# EasyEDA schematic SCH_PCB_33KV_2026-04-21.json
TITLE: Sheet_1; REV: 1.0; Date: 2026-04-07; Sheet: 1/1; Drawn By: gamepoko56; Company: Your Company
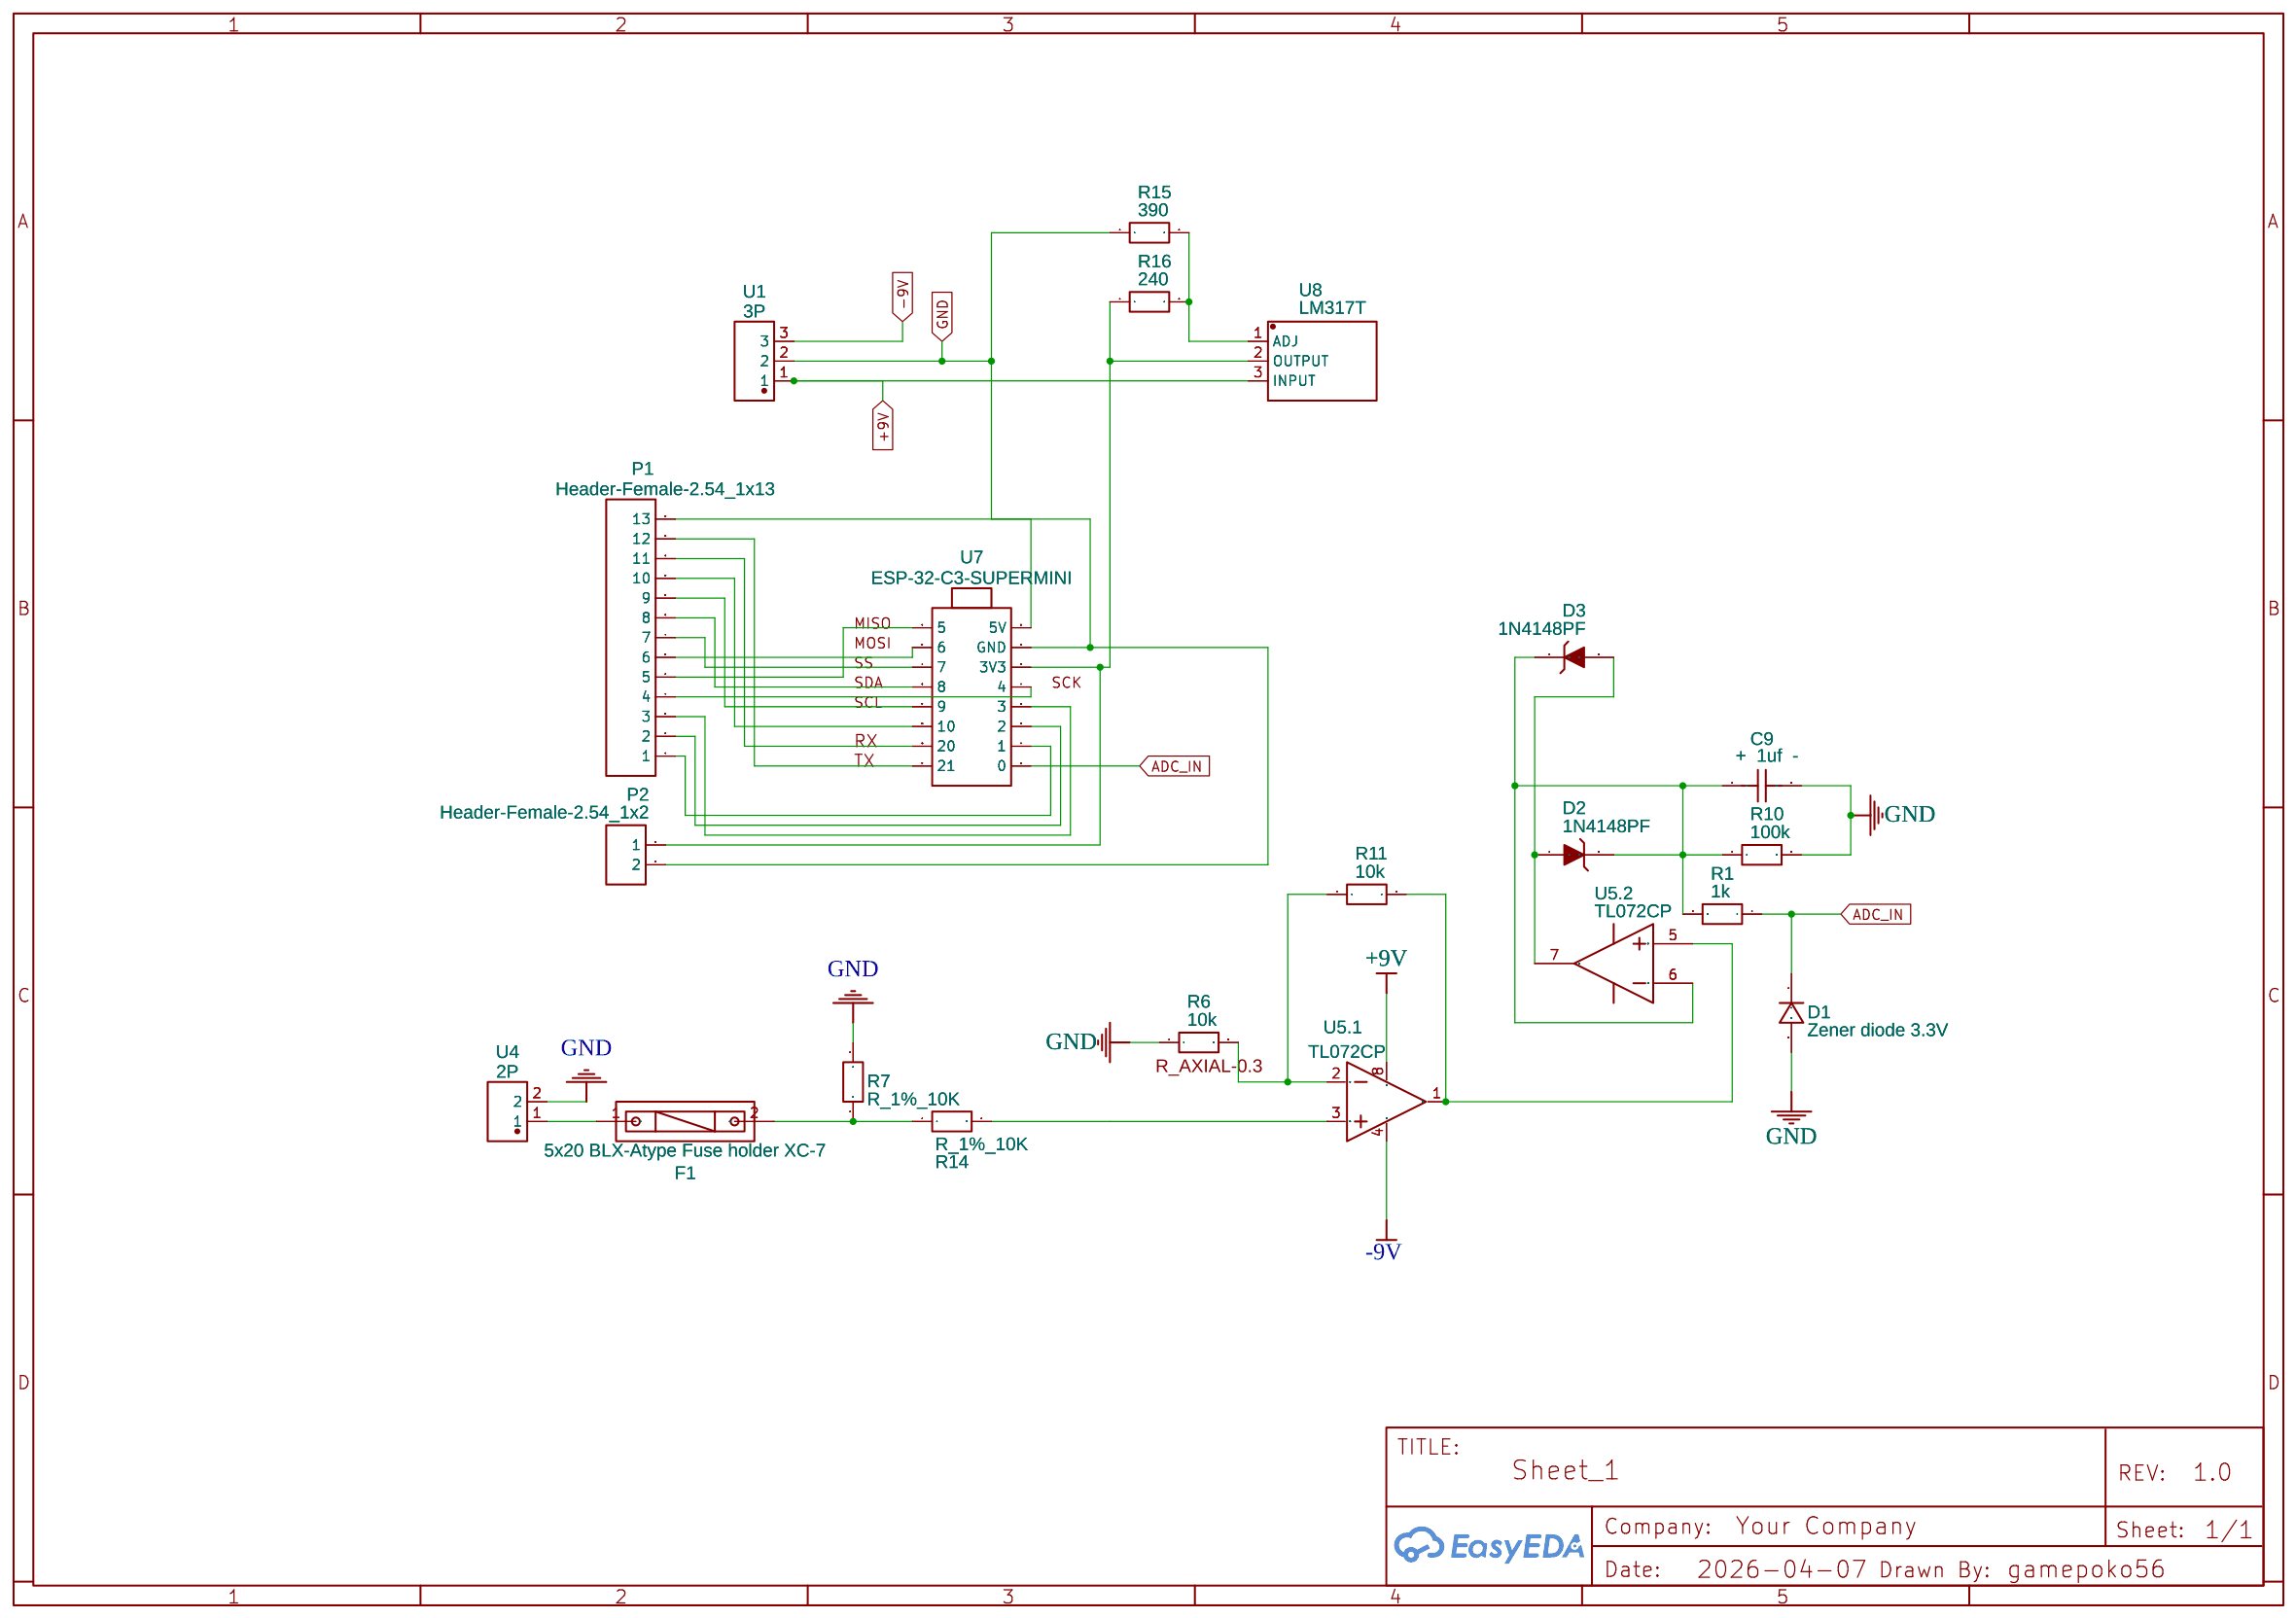
[diagram p0: schematic sheet]

## Parts
C9  +  1uf  -  [R_AXIAL-0.3]
D1  Zener diode 3.3V  [SOD-123_L2.8-W1.8-LS3.7-RD]
D2  1N4148PF  [DO-35_BD1.9-L3.9-P7.90-D0.5-FD]
D3  1N4148PF  [DO-35_BD1.9-L3.9-P7.90-D0.5-FD]
F1  5x20 BLX-Atype Fuse holder XC-7  [FUSE-TH_L22.6-W9.0]
P1  Header-Female-2.54_1x13  [HDR-TH_13P-P2.54-V-F]
P2  Header-Female-2.54_1x2  [HDR-TH_2P-P2.54-V-F]
R1  1k  [R_AXIAL-0.3]
R6  10k  [R_AXIAL-0.3]
R7  R_1%_10K  [R_AXIAL-0.3]
R10  100k  [R_AXIAL-0.3]
R11  10k  [R_AXIAL-0.3]
R14  R_1%_10K  [R_AXIAL-0.3]
R15  390  [R_AXIAL-0.3]
R16  240  [R_AXIAL-0.3]
U1  3P  [KF301-5.0-3P_1]
U4  2P  [CONN-TH_P5.00_KF301-5.0-2P]
U5  TL072CP  [PIT_DIP-8]  (sections 1,2)
U7  ESP-32-C3-SUPERMINI  [ESP32-C3-SUPERMINI-PCB]
U8  LM317T  [TO-220AB-3_L10.4-W4.6-P2.54-T]

## Library data of the parts
C9 = C_0603_US: Contributor: LCEDA_Lib
D1 = 1N4007W: Supplier: LCSC; Supplier Part: C328592; Manufacturer: BLUE ROCKET; Contributor: LCEDA_Lib
D2 D3 = 1N4148PF: Contributor: lcsc; Supplier: LCSC; Supplier Part: C2992430; Manufacturer: ST(先科); JLCPCB Part Class: Extended Part
F1 = 5x20 BLX-Atype Fuse holder XC-7: Supplier: LCSC; Manufacturer Part: 5x20 BLX-A型 保险丝支架 XC-7; Manufacturer: xcfuse(旭程); Supplier Part: C3131; JLCPCB Part Class: Extended Part
P1 = Header-Female-2.54_1x13: Supplier: LCSC; Manufacturer: BOOMELE(博穆精密); Manufacturer Part: 2.54-1*13P母; Supplier Part: C52709; JLCPCB Part Class: Extended Part
P2 = Header-Female-2.54_1x2: Supplier: LCSC; Manufacturer: BOOMELE(博穆精密); Manufacturer Part: 2.54-1*2P母; Supplier Part: C49661; JLCPCB Part Class: Extended Part
R1 R7 R10 R11 R14-R16 = R_0603_EU: Contributor: LCEDA_Lib
R6 = R_0603_EU: Contributor: LCEDA_Lib; Package Display: Yes
U1 = KF301-5.0-3P: Contributor: LCSC; Supplier: LCSC; Supplier Part: C474882; Manufacturer: KEFA(科发); JLCPCB Part Class: Extended Part
U4 = KF301-5.0-2P: Contributor: LCSC; Supplier: LCSC; Supplier Part: C474881; Manufacturer: KEFA(科发); JLCPCB Part Class: Extended Part
U5 = TL072CP: tags: FET Operational Amplifier; Supplier Part: C7236; Supplier: LCSC; Manufacturer: TI; subpart_no: 1
U7 = ESP-32-C3-SUPERMINI: Contributor: rodriguezsalazarluisgabriel2
U8 = LM317T: Contributor: LCSC; Supplier: LCSC; Supplier Part: C361026; Manufacturer: ST(意法半导体); JLCPCB Part Class: Extended Part

## Nets
+9V: U1.1 U5.8(VCC+) U8.3(INPUT)
-9V: U1.3 U5.4(VCC-)
GND: C9.2 D1.2 P2.2 R6.1 R7.2 R10.2 R15.1 U1.2 U4.2 U7.GND
ADC_IN: D1.1 R1.1 U7.0
Net-(C9-1): C9.1 D2.2 D3.2 R1.2 R10.1 U5.6(IN2-)
Net-(D2-1): D2.1 D3.1 U5.7(OUT2)
Net-(F1-1): F1.1 U4.1
Net-(F1-2): F1.2 R7.1 R14.1
Net-(P1-1): P1.1 U7.1
Net-(P1-2): P1.2 U7.2
Net-(P1-3): P1.3 U7.3
Net-(P1-4): P1.4 U7.4
Net-(P1-5): P1.5 U7.5
Net-(P1-6): P1.6 U7.6
Net-(P1-7): P1.7 U7.7
Net-(P1-8): P1.8 U7.8
Net-(P1-9): P1.9 U7.9
Net-(P1-10): P1.10 U7.10
Net-(P1-11): P1.11 U7.20
Net-(P1-12): P1.12 U7.21
Net-(P1-13): P1.13 U7.5V
Net-(P2-1): P2.1 R16.1 U7.3V3 U8.2(OUTPUT)
Net-(R6-2): R6.2 R11.1 U5.2(IN1-)
Net-(R11-2): R11.2 U5.1(OUT1) U5.5(IN2+)
Net-(R14-2): R14.2 U5.3(IN1+)
Net-(R15-2): R15.2 R16.2 U8.1(ADJ)
